# Altium project us_#2.PrjPcb
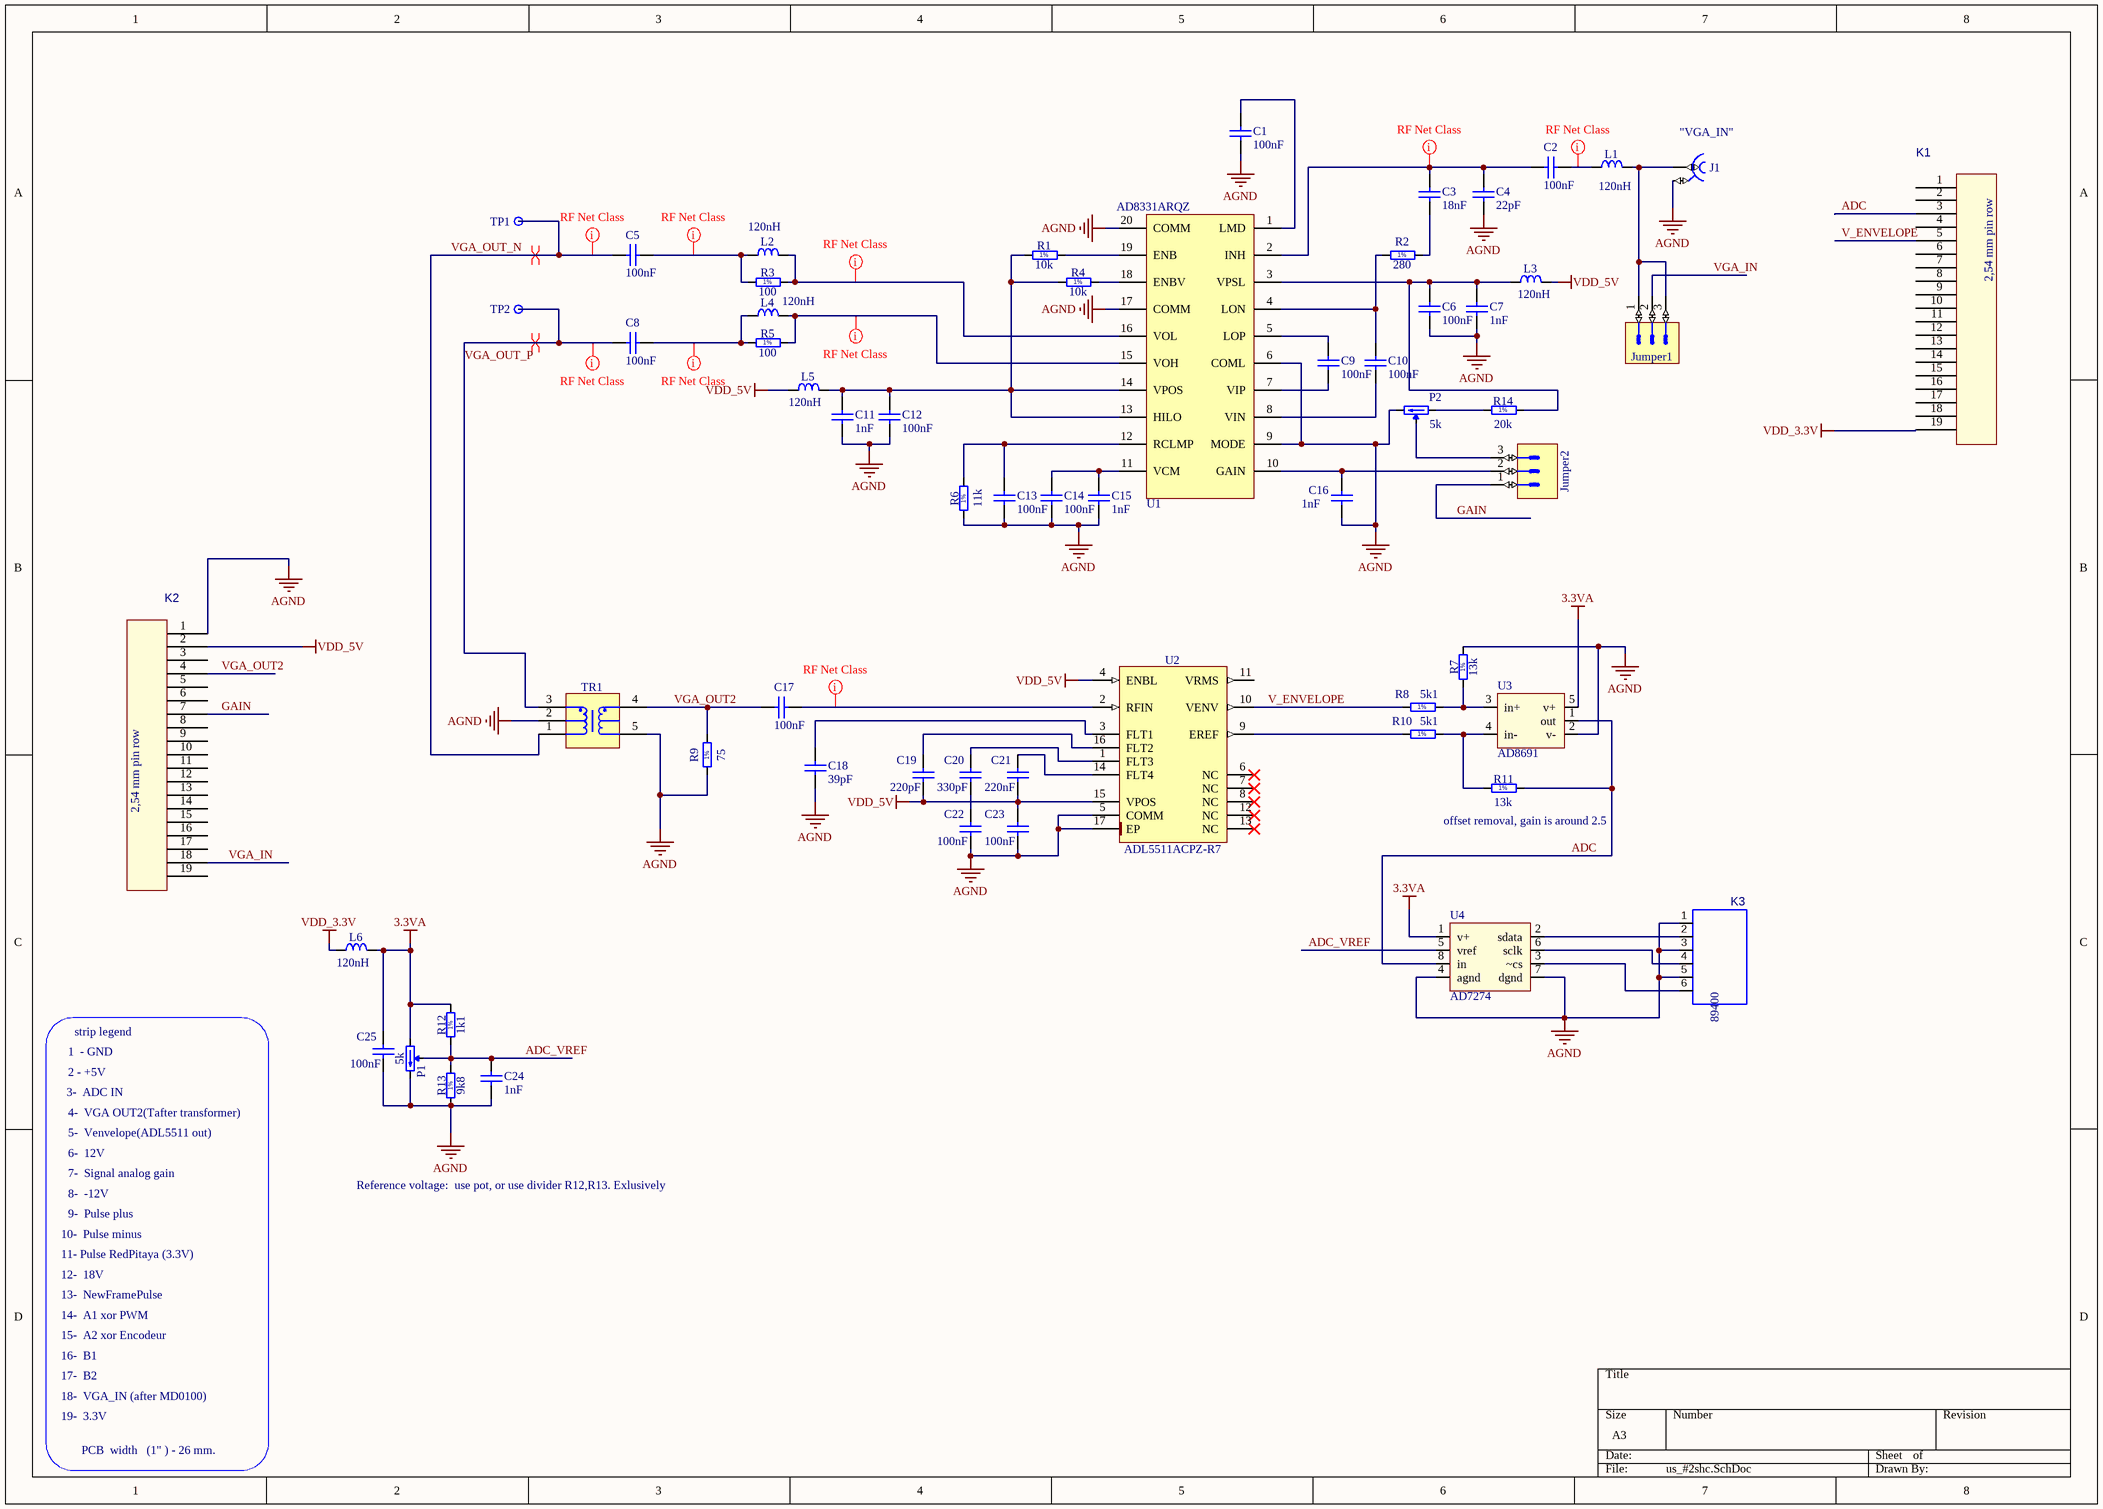
[diagram p0: us_#2shc.SchDoc]
1 sheet, 60 parts. Net scope: global (net labels, ports and power ports of the same name join across sheets).
Board files: us_#2.PcbDoc, PCB1_logo.PcbDoc

## Sheet us_#2shc.SchDoc
size A3

### Parts
C1  value 100nF  [SM0603 _3D_cap]  (hidden comment: cap0603)
C2  value 100nF  [SM0603 _3D_cap]  (hidden comment: cap0603)
C3  value 18nF  [SM0603 _3D_cap]  (hidden comment: cap0603)
C4  value 22pF  [SM0603 _3D_cap]  (hidden comment: cap0603)
C5  value 100nF  [SM0603 _3D_cap]  (hidden comment: cap0603)
C6  value 100nF  [SM0603 _3D_cap]  (hidden comment: cap0603)
C7  value 1nF  [SM0603 _3D_cap]  (hidden comment: cap0603)
C8  value 100nF  [SM0603 _3D_cap]  (hidden comment: cap0603)
C9  value 100nF  [SM0603 _3D_cap]  (hidden comment: cap0603)
C10  value 100nF  [SM0603 _3D_cap]  (hidden comment: cap0603)
C11  value 1nF  [SM0603 _3D_cap]  (hidden comment: cap0603)
C12  value 100nF  [SM0603 _3D_cap]  (hidden comment: cap0603)
C13  value 100nF  [SM0603 _3D_cap]  (hidden comment: cap0603)
C14  value 100nF  [SM0603 _3D_cap]  (hidden comment: cap0603)
C15  value 1nF  [SM0603 _3D_cap]  (hidden comment: cap0603)
C16  value 1nF  [SM0603 _3D_cap]  (hidden comment: cap0603)
C17  value 100nF  [SM0603 _3D_cap]  (hidden comment: cap0603)
C18  value 39pF  [SM0603 _3D_cap]  (hidden comment: cap0603)
C19  value 220pF  [SM0603 _3D_cap]  (hidden comment: cap0603)
C20  value 330pF  [SM0603 _3D_cap]  (hidden comment: cap0603)
C21  value 220nF  [SM0603 _3D_cap]  (hidden comment: cap0603)
C22  value 100nF  [SM0603 _3D_cap]  (hidden comment: cap0603)
C23  value 100nF  [SM0603 _3D_cap]  (hidden comment: cap0603)
C24  value 1nF  [SM0603 _3D_cap]  (hidden comment: cap0603)
C25  value 100nF  [SM0603 _3D_cap]  (hidden comment: cap0603)
J1  SMA  [AMPHENOL_132357-11]  (value not drawn)
Jumper1  (no value)  [SULLINS_GRPB031VWVN]
Jumper2  (no value)  [SULLINS_GRPB031VWVN]
K1  PLS_2.54mm-19  [PLS_2.54mm-19]  (value not drawn)
K2  PLS_2.54mm-19  [PLS_2.54mm-19]  (value not drawn)
K3  Molex_89400_061  [Molex_89400-061]  (value not drawn)
L1  75R@100MHz  [SM_0805_INDUCTANCE _3D]  (value not drawn)
L2  75R@100MHz  [SM_0805_INDUCTANCE _3D]  (value not drawn)
L3  75R@100MHz  [SM_0805_INDUCTANCE _3D]  (value not drawn)
L4  75R@100MHz  [SM_0805_INDUCTANCE _3D]  (value not drawn)
L5  75R@100MHz  [SM_0805_INDUCTANCE _3D]  (value not drawn)
L6  75R@100MHz  [SM_0805_INDUCTANCE _3D]  (value not drawn)
P1  5k  [TRIM_BOURNS_3223W]
P2  5k  [TRIM_BOURNS_3223W]
R1  10k  [SM0603_3D_res]
R2  280  [SM0603_3D_res]
R3  100  [SM0603_3D_res]
R4  10k  [SM0603_3D_res]
R5  100  [SM0603_3D_res]
R6  11k  [SM0603_3D_res]
R7  13k  [SM0603_3D_res]
R8  5k1  [SM0603_3D_res]
R9  75  [SM0603_3D_res]
R10  5k1  [SM0603_3D_res]
R11  13k  [SM0603_3D_res]
R12  1k1  [SM0603_3D_res]
R13  9k8  [SM0603_3D_res]
R14  20k  [SM0603_3D_res]
TP1  Test Point  [NICOMATIC_C12000B]  (value not drawn)
TP2  Test Point  [NICOMATIC_C12000B]  (value not drawn)
TR1  1:1  [Pulse_CX2041NL]  (value not drawn)
U1  AD8331ARQZ  [SOP64P600X175-20N]
U2  ADL5511ACPZ-R7  [QFN50P300X300X80-17N-S175]
U3  AD8691  [TSOT-5(RT-5)]
U4  AD7274  [RM-8]

### Nets
3.3VA: C25.2 L6.2 P1.1(CCW) R12.2 U3.5(v+) U4.1(v+)
AGND: C1.1 C4.1 C6.1 C7.1 C11.1 C12.1 C13.1 C14.1 C15.1 C16.1 C18.1 C22.1 C23.1 C24.1 C25.1 J1.2 K2.1 K3.1 K3.3 K3.5 P1.3(CW) P2.3(CW) R6.1 R7.2 R9.1 R13.1 TR1.2(NC) TR1.5 U1.6(COML) U1.9(MODE) U1.17(COMM) U1.20(COMM) U2.5(COMM) U2.17(EP) U3.2(v-) U4.4(agnd) U4.7(dgnd)
VDD_3.3V: K1.19 L6.1
VDD_5V: C19.1 C21.1 C23.2 K2.2 L3.2 L5.1 U2.4(ENBL) U2.15(VPOS)
ADC: K1.3 R11.2 U3.1(out) U4.8(in)
ADC_VREF: C24.2 P1.2(W) R12.1 R13.2 U4.5(vref)
GAIN: Jumper2.1 K2.7
V_ENVELOPE: K1.5 R8.1 U2.10(VENV)
VGA_IN: Jumper1.2 K2.18
VGA_OUT2: C17.1 K2.4 R9.2 TR1.4(SDOT)
VGA_OUT_N: C5.1 TP1.1 TR1.1(P)
VGA_OUT_P: C8.2 TP2.1 TR1.3(PDOT)
NetC1_2: C1.2 U1.1(LMD)
NetC2_1: C2.1 C3.2 C4.2 U1.2(INH)
NetC2_2: C2.2 L1.1
NetC3_1: C3.1 R2.2
NetC5_2: C5.2 L2.1 R3.1
NetC6_2: C6.2 C7.2 L3.1 R14.2 U1.3(VPSL)
NetC8_1: C8.1 L4.1 R5.1
NetC9_1: C9.1 U1.7(VIP)
NetC9_2: C9.2 U1.5(LOP)
NetC10_1: C10.1 U1.8(VIN)
NetC10_2: C10.2 R2.1 U1.4(LON)
NetC11_2: C11.2 C12.2 L5.2 R1.1 R4.1 U1.13(HILO) U1.14(VPOS)
NetC13_2: C13.2 R6.2 U1.12(RCLMP)
NetC14_2: C14.2 C15.2 U1.11(VCM)
NetC16_2: C16.2 Jumper2.2 U1.10(GAIN)
NetC17_2: C17.2 U2.2(RFIN)
NetC18_2: C18.2 U2.3(FLT1)
NetC19_2: C19.2 U2.16(FLT2)
NetC20_1: C20.1 C22.2
NetC20_2: C20.2 U2.1(FLT3)
NetC21_2: C21.2 U2.14(FLT4)
NetJ1_1: J1.1 Jumper1.1 Jumper1.3 L1.2
NetJumper2_3: Jumper2.3 P2.2(W)
NetK3_2: K3.2 U4.2(sdata)
NetK3_4: K3.4 U4.6(sclk)
NetK3_6: K3.6 U4.3(~cs)
NetL2_2: L2.2 R3.2 U1.16(VOL)
NetL4_2: L4.2 R5.2 U1.15(VOH)
NetP2_1: P2.1(CCW) R14.1
NetR1_2: R1.2 U1.19(ENB)
NetR4_2: R4.2 U1.18(ENBV)
NetR7_1: R7.1 R8.2 U3.3(in+)
NetR10_1: R10.1 U2.9(EREF)
NetR10_2: R10.2 R11.1 U3.4(in-)

Not connected (* = marked no-connect by the designer): K1 1 2 4 6 7 8 9 10 11 12 13 14 15 16 17 18; K2 3 5 6 8 9 10 11 12 13 14 15 16 17 19; U2 6(NC)* 7(NC)* 8(NC)* 11(VRMS) 12(NC)* 13(NC)*

### Layout directives
net class RF: NetC2_1, NetC2_2, NetC5_2, NetC8_1, NetC17_2, NetL2_2, NetL4_2, VGA_OUT_N, VGA_OUT_P
differential pair: VGA_OUT_N, VGA_OUT_P

### Notes on the sheet
- (near J1) "VGA_IN"
- (near L2) 120nH
- (near L1) 120nH
- 120nH
- (near L3) 120nH
- (near L5) 120nH
- (near R11) offset removal, gain is around 2.5
- (near L6) 120nH
- 1  - GND
- strip legend
- 3-  ADC IN
- 2 - +5V
- 4-  VGA OUT2(Tafter transformer)
- 5-  Venvelope(ADL5511 out)
- 6-  12V
- 7-  Signal analog gain
- Reference voltage:  use pot, or use divider R12,R13. Exlusively
- 10-  Pulse minus
- 11- Pulse RedPitaya (3.3V)
- 8-  -12V
- 9-  Pulse plus
- 12-  18V
- 13-  NewFramePulse
- 14-  A1 xor PWM
- 15-  A2 xor Encodeur
- 16-  B1
- 17-  B2
- 18-  VGA_IN (after MD0100)
- 19-  3.3V
- PCB  width   (1" ) - 26 mm.
- (in symbol Molex_89400_061) 89400
- (in symbol PLS_2.54mm-19) 2,54 mm pin row
- (in symbol Res_0603_1%_EU) 1%
- (in symbol XFMR_MINI-CIRCUITS_T1-6T-KK81) SEC; PRI

### Library data of the parts
C1-C25 = cap0603: Capacitor  0603 inch; Published: 8-Jun-2000; LatestRevisionDate: 17-Jul-2002; LatestRevisionNote: Re-released for DXP Platform.; PackageReference: RAD-0.3; Publisher: Altium Limited; PackageDescription: Radial Cap, Thru-Hole; 2 Leads; 0.3 in Pin Spacing
J1 = Coax_1Female_1Shield: Part Description: SMA End Launch Jack for 1.58mm PCB, 50 Ohm, Flat Tab Contact; Manufacturer: AMPHENOL; Manufacturer Part Number: 132357-11; Part Number: AMPHENOL_132357-11; Component Kind: Standard; Component Type: Standard; Pin Count: 2; Family: SMA; Mounted: Yes; Socket: No; SMD: Yes; Status: None; ComponentHeight: 7.92mm; HelpURL: \\cern.ch\dfs\Applications\Altium\Datasheets\AMPHENOL_132357-11.pdf; Author: CERN DEM JLC; CreateDate: 5/14/2012; LatestRevisionDate: 5/14/2012; Table: AMPHENOL
Jumper1 Jumper2 = SULLINS_GRPB031VWVN: Connector 3 Male; Part Description: 3 Contact 0.5" Pitch Single-In-Line Vertical Header; Table: Miscellaneous; Part Number: SULLINS_GRPB031VWVN; Component Kind: Standard; Component Type: Standard; Pin Count: 3; Mounted: Yes; Socket: No; SMD: No; Status: None; Manufacturer: SULLINS; Manufacturer Part Number: GRPB031VWVN; ComponentHeight: 4mm; Author: S. Jafar; CreateDate: 12/29/2015; LatestRevisionDate: 12/29/2015
K3 = Molex_89400_061: 6 pin vertical 2mm; Value: *
L1-L6 = Ind_Chip: chip inductance; Part Number: IND0805_MURATA_BLM21BB750SN1D; Part Description: SMD EMIFIL Suppression Chip Ferrite Bead; Manufacturer: MURATA; Manufacturer Part Number: BLM21BB750SN1D; Power: 700mA; Resistance: 0.16R; Tolerance: ±25%; Table: Inductors SMD; Component Kind: Standard; Component Type: Standard; Footprint: INDC2012X105N; Pin Count: 2; Value: 75R@100MHz; Status: None; Case: 0805; Mounted: Yes; Socket: No; SMD: Yes; ComponentHeight: 1.05mm; Author: S. Jafar; CreateDate: 12/21/2015; LatestRevisionDate: 12/21/2015
P1 P2 = Trimming Potentiometer: Part Number: TRIM_11T_5K_BOURNS_3223W-1-502E; Part Description: 11 Turns SMD Trimpot® Trimming Potentiometer (Top Adjust); Manufacturer: BOURNS; Manufacturer Part Number: 3223W-1-502E; Power: 0.125W; TC: ±100ppm/°C; Tolerance: ±20%; Table: Potentiometers SMD; Component Kind: Standard; Component Type: Standard; Pin Count: 3; Value: 5k; Case: 3223W; Mounted: Yes; Socket: No; SMD: Yes; ComponentHeight: 4.16mm; HelpURL: \\cern.ch\dfs\Applications\Altium\Datasheets\TRIM_BOURNS_3223W.pdf; Author: CERN DEM JLC; CreateDate: 3/31/2011; LatestRevisionDate: 12/18/2012
R1-R14 = Res_0603_1%_EU: Part Number: R1206_4K7_1%_0.25W_100PPM; Part Description: General Purpose Thick Film Chip Resistor; Manufacturer: GENERIC; Manufacturer1 Part Number: NRC12F4701TRF; Value: 4k7; Power: 0.25W; TC: ±100ppm/°C; Tolerance: ±1%; Table: Resistors SMD; Component Kind: Standard; Component Type: Standard; Footprint: RESC3216X65N; Pin Count: 2; Status: Preferred; Manufacturer Part Number: R1206_4K7_1%_0.25W_100PPM; Case: 1206; Mounted: Yes; Socket: No; SMD: Yes; Manufacturer1 Example: NIC COMPONENT; Manufacturer1 ComponentHeight: 0.65mm; HelpURL: \\cern.ch\dfs\Applications\Altium\Datasheets\R1206_NIC_NRC.pdf; Author: CERN DEM JLC; CreateDate: 12/3/2007; LatestRevisionDate: 3/13/2008
TP1 TP2 = NICOMATIC_C12000B: Part Description: SMD Test Point; Table: Miscellaneous; Part Number: NICOMATIC_C12000B; Component Kind: Standard; Component Type: Standard; Pin Count: 1; Family: Test Point; Mounted: Yes; Socket: No; SMD: Yes; Status: None; Manufacturer: NICOMATIC; Manufacturer Part Number: C12000B; ComponentHeight: 1.5mm; HelpURL: \\cern.ch\dfs\Applications\Altium\Datasheets\NICOMATIC_C12000B.pdf; Author: CERN DEM JLC; CreateDate: 3/25/2009; LatestRevisionDate: 3/25/2009
TR1 = Pulse_CX2041NL: 75 Ohm 0.05 to 300MHz RF Transformers; Part Number: XFMR_MINI-CIRCUITS_T1-6T-KK81; Part Description: 50 Ohms 0.015 To 300MHz RF Transformers; Manufacturer: MINI-CIRCUITS; Manufacturer Part Number: T1-6T-KK81; Component Kind: Standard; Component Type: Standard; Footprint: XFMR_MINI-CIRCUITS_KK81; Pin Count: 5; Value: 1:1; Status: None; Mounted: Yes; Socket: No; SMD: Yes; ComponentHeight: 6.6mm; Author: S. Jafar; CreateDate: 12/22/2015; LatestRevisionDate: 1/10/2016; Table: Transformers
U1 = AD8331ARQZ: Part Description: Ultralow Noise VGAs with Preamplifier and Programmable RIN; Manufacturer: Analog Devices; Table: Analog & Interface; Part Number: AD8331ARQZ; Component Kind: Standard; Component Type: Standard; Device: AD8331ARQZ; PackageDescription: SOP, 20-Leads, Body 8.66x3.91mm, Pitch 0.64mm, IPC Medium Density; Manufacturer Part Number: AD8331ARQZ; Pin Count: 20; Case: QSOP-20; Mounted: Yes; Socket: No; SMD: Yes; ComponentHeight: 1.75mm; Author: S. Jafar; CreateDate: 12/20/2015; LatestRevisionDate: 1/6/2016
U2 = ADL5511ACPZ-R7: DC to 6 GHz Envelope and TruPwr RMS Detector; Manufacturer: ANALOG DEVICES; Table: Analog & Interface; Part Number: ADL5511ACPZ-R7; Component Kind: Standard; Component Type: Standard; Device: ADL5511ACPZ-R7; PackageDescription: QFN, 0.50mm Pitch, Square; 16 Pin, 3.00mm L X 3.00mm W X 0.80mm H Body (w/Thermal Tab 1.75 X 1.75mm),  IPC Medium Density; Part Description: DC to 6 GHz Envelope and TruPwr RMS Detector; Manufacturer Part Number: ADL5511ACPZ-R7; Pin Count: 17; Case: QFN16; Mounted: Yes; Socket: No; SMD: Yes; ComponentHeight: 0.8mm; Author: CERN DEM JLC; HelpURL: \\cern.ch\dfs\Applications\Altium\Datasheets\ADL5511ACPZ-R7.pdf; CreateDate: 11/15/2012; LatestRevisionDate: 11/15/2012
U3 = OpAmp_TSOT5
U4 = AD7274: adc serial